# Altium schematic sheet LPCB225 - DISCHARGE NODE.SchDoc
size A3; Address1: Factory 10; Address2: 9-13 Dingley Avenue, Dandeong, VICTORIA 3175, AUSTRALIA; Revision: 1; SheetNumber: 1; SheetTotal: ?; Lockie__PCB_SUB_ASSEMBLY: PCB Sub Component; Lockie__PCB_ASSEMBLY: PCB Assembly; Lockie__LDL: LPCBxxx; Lockie__PCB_DESCRIPTION: PCB Description
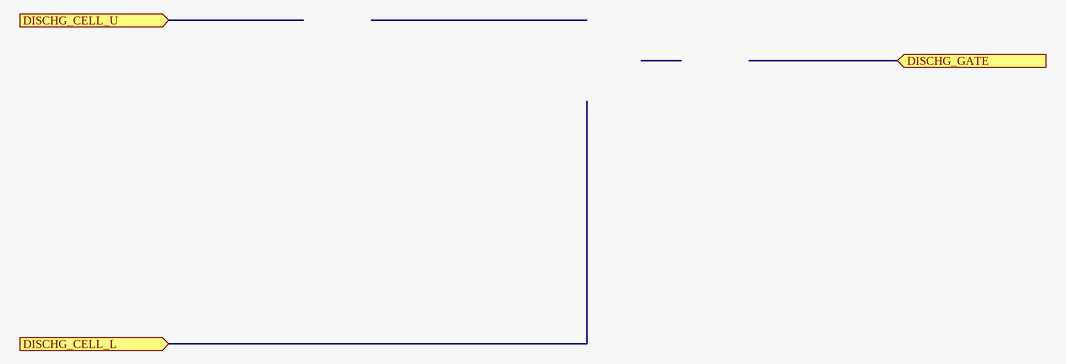
[diagram p0: LPCB225 - DISCHARGE NODE.SchDoc]

## Ports
DISCHG_CELL_L (in), DISCHG_CELL_U (in), DISCHG_GATE (in)

## Notes on the sheet
- PCB COMPONENT DESCRIPTION
- LDL NUMBER
- Assembly Details
- Size
- Drawing File Name
- Revision
- http://sil3.com.au
  ACN: 123 529 064
  Factory 10
  9-13 Dingley Avenue
  Dandenong, VICTORIA
  Australia
- Scale
- A3
- Sheet Details
- N.T.S
- Sheet:
- Of: